# Altium schematic sheet ESenseFE-PreAmpAndMux.SchDoc
size C
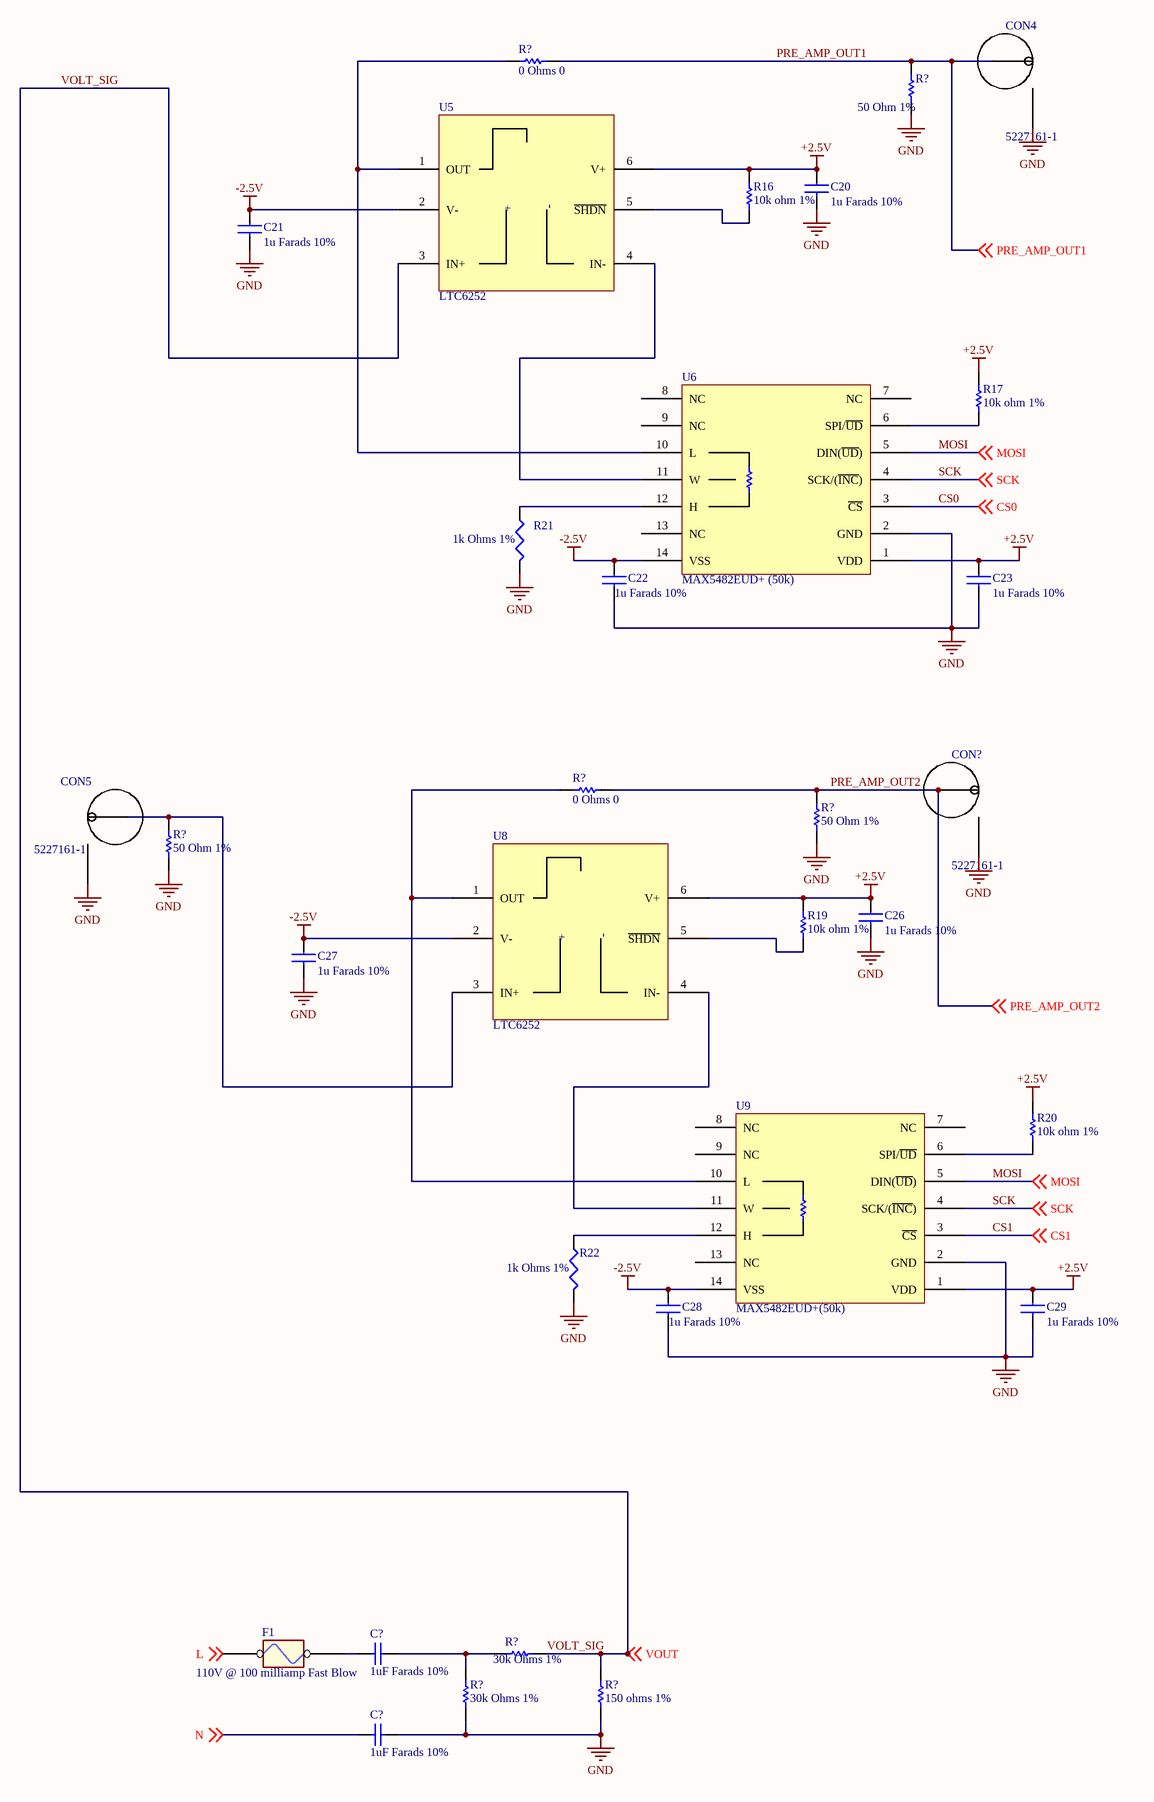
[diagram p0: ESenseFE-PreAmpAndMux.SchDoc]

## Parts
(Parts that share a designator on the sheet are numbered #1, #2 ... from top to bottom, then left to right.)
C20  1u Farads 10%  [SM/C_0603]
C21  1u Farads 10%  [SM/C_0603]
C22  1u Farads 10%  [SM/C_0603]
C23  1u Farads 10%  [SM/C_0603]
C26  1u Farads 10%  [SM/C_0603]
C27  1u Farads 10%  [SM/C_0603]
C28  1u Farads 10%  [SM/C_0603]
C29  1u Farads 10%  [SM/C_0603]
C?#1  1uF Farads 10%  [Y2-Caps-Epocs-1uF-10%]
C?#2  1uF Farads 10%  [Y2-Caps-Epocs-1uF-10%]
CON4  5227161-1  [BNC-RightAngle-PCB-50Ohm-Termination]
CON5  5227161-1  [BNC-RightAngle-PCB-50Ohm-Termination]
CON?  5227161-1  [BNC-RightAngle-PCB-50Ohm-Termination]
F1  110V @ 100 milliamp Fast Blow  [WICKMANN/WK0011-ND]
R16  10k ohm 1%  [SM/C_0603]
R17  10k ohm 1%  [SM/C_0603]
R19  10k ohm 1%  [SM/C_0603]
R20  10k ohm 1%  [SM/C_0603]
R21  1k Ohms 1%  [SM/C_0603]
R22  1k Ohms 1%  [SM/C_0603]
R?#1  0 Ohms 0  [SM/R_0603]
R?#2  50 Ohm 1%  [SM/R_0603]
R?#3  0 Ohms 0  [SM/R_0603]
R?#4  50 Ohm 1%  [SM/R_0603]
R?#5  50 Ohm 1%  [SM/R_0603]
R?#6  30k Ohms 1%  [SM/R_2512]
R?#7  30k Ohms 1%  [SM/R_2512]
R?#8  150 ohms 1%  [SM/R_2512]
U5  LTC6252  [TSOT-23-LTC6252-OpAmp]
U6  MAX5482EUD+ (50k)  [TSSOP-16Lead-MAX548X]
U8  LTC6252  [TSOT-23-LTC6252-OpAmp]
U9  MAX5482EUD+(50k)  [TSSOP-16Lead-MAX548X]

## Nets
+2.5V: C20.1 C23.1 C26.1 C29.1 R16.2 R17.2 R19.2 R20.2 U5.6(V+) U6.1(VDD) U8.6(V+) U9.1(VDD)
-2.5V: C21.1 C22.1 C27.1 C28.1 U5.2(V-) U6.14(VSS) U8.2(V-) U9.14(VSS)
GND: C20.2 C21.2 C22.2 C23.2 C26.2 C27.2 C28.2 C29.2 C?#2.2 CON4.2 CON5.2 CON?.2 R21.2 R22.2 R?#2.1 R?#4.1 R?#5.1 R?#7.1 R?#8.1 U6.2(GND) U9.2(GND)
CS0: U6.3(~{CS}) ; off-sheet CS0
CS1: U9.3(~{CS}) ; off-sheet CS1
L: F1.1 ; off-sheet L
MOSI: U6.5(DIN(~{UD})) U9.5(DIN(~{UD})) ; off-sheet MOSI
N: C?#2.1 ; off-sheet N
PRE_AMP_OUT1: CON4.1 R?#1.2 R?#2.2 ; off-sheet PRE_AMP_OUT1
PRE_AMP_OUT2: CON?.1 R?#3.2 R?#4.2 ; off-sheet PRE_AMP_OUT2
SCK: U6.4(SCK/(~{INC})) U9.4(SCK/(~{INC})) ; off-sheet SCK
VOLT_SIG: R?#6.1 R?#8.2 U5.3(IN+) ; off-sheet VOUT  [also labelled VOUT]
NetC?#1_1: C?#1.1 F1.2
NetC?#1_2: C?#1.2 R?#6.2 R?#7.2
NetCON5_1: CON5.1 R?#5.2 U8.3(IN+)
NetR16_1: R16.1 U5.5(~{SHDN})
NetR17_1: R17.1 U6.6(SPI/~{UD})
NetR19_1: R19.1 U8.5(~{SHDN})
NetR20_1: R20.1 U9.6(SPI/~{UD})
NetR21_1: R21.1 U6.12(H)
NetR22_1: R22.1 U9.12(H)
NetR?#1_1: R?#1.1 U5.1(OUT) U6.10(L)
NetR?#3_1: R?#3.1 U8.1(OUT) U9.10(L)
NetU5_4: U5.4(IN-) U6.11(W)
NetU8_4: U8.4(IN-) U9.11(W)

Not connected (* = marked no-connect by the designer): U6 7(NC) 8(NC) 9(NC) 13(NC); U9 7(NC) 8(NC) 9(NC) 13(NC)

## Notes on the sheet
- (in symbol 2192) +; -

## Library data of the parts
C20-C23 C26-C29 = 2065: CAP CER 1.0UF 10V 10% X5R 0603; mfrName: Murata Electronics North America; mfrPartNum: GRM188R61A105KA61D; Extra_Description: Datasheets	Chip Monolithic Ceramic Caps Part Numbering / GRM Series Spec/Test Methods (1) / GRM188R61A105KA61 / Product Photos	0603 Murata MLCC Caps / Product Training Modules	High-Cap Multilayer Ceramic Capacitors / Catalog Drawings	GRM Series Top, Sides / Standard Package	10 / Category	Capacitors / Family	Ceramic / Series	GRM / Capacitance	1.0µF / Voltage - Rated	10V / Tolerance	±10% / Temperature Coefficient	X5R / Mounting Type	Surface Mount, MLCC / Operating Temperature	-55°C ~ 85°C / Features	- / Applications	General Purpose / Ratings	- / Package / Case	0603 (1608 Metric) / Size / Dimension	0.063`` L x 0.032`` W (1.60mm x 0.80mm) / Lead Spacing	- / Thickness	0.80mm / Packaging	Cut Tape (CT) / Lead Style	- / Catalog Page	1886 (US2010 Interactive) / 1886 (US2010 PDF) / Other Names	490-1543-1; Obsolete: False; Temp_Max: 0; Type: Ceramic; PartID: 2065; URL_Image: HTTP://MEDIA.DIGIKEY.COM/PHOTOS/MURATA%20PHOTOS/0603%20MURATA%20MLCC%20CAPS.JPG; URL_Datasheet: http://search.murata.co.jp/Ceramy/image/img/w_hinm/L0005E.pdf; Date_Created: 9/27/2010 4:47:48 PM; Date_LastModified: 9/27/2010 4:47:48 PM; Verified: False; RoHS: True; Temp_Min: 0
C?#1 C?#2 = 2202: Y2 Caps 1uF Epocs; mfrName: EPCOS; mfrPartNum: B32026B3105K; Obsolete: False; Temp_Max: 0; Type: All Parts; TypeNotes: Applies to all parts in the database; Label: 1uF; PartID: 2202; Extra_Description: Y2 Caps 1uF Epocs; URL_Image: http://www.mouser.com/images/epcos/images/812007111135.jpg; URL_Datasheet: http://www.epcos.com/inf/20/20/db/fc_2009/Y2_B32021_026.pdf; Date_Created: 5/7/2011 9:37:20 PM; Date_LastModified: 5/7/2011 9:37:20 PM; Verified: False; RoHS: True; Temp_Min: 0
CON4 CON5 CON? = 2189: jack bnc, right angle, pcb; connector type:bnc, coaxial;; mfrName: Tyco Electronics; Extra_Description: JACK BNC, RIGHT ANGLE, PCB; Connector Type:BNC, Coaxial; Impedance:50ohm; Contact Material:Phosphor Bronze; Contact Plating:Tin; Body Style:Right Angle; Termination Method:PC Board; Mounting Type:PC Board; External Depth:35.56mm; External Length / Height:13.18mm; Material:VALOX; Width, External:14.76mm; Dielectric Material:Polymethylpentene / Contact Plating: ``Tin`` / Termination Style: ``Solder Lug`` / Gender: ``Female`` / Packaging: ``Bulk`` / RoHS: ``Compliant`` / Mounting Type: ``PC Board`` / Lead-Free Status: ``Lead Free`` / Contact Material: ``Phosphor Bronze`` / Housing Material: ``Polyester`` / Color: ``White`` / Size-Height: { / ``uncertainty_minus``: null, / ``value``: 0.015875, / ``uncertainty_plus``: null / } / Frequency: { / ``max_value``: 4000000000.0, / ``max_uncertainty_plus``: null, / ``min_value``: null, / ``min_uncertainty_plus``: null, / ``max_uncertainty_minus``: null / }; Obsolete: False; Temp_Max: 0; TypeNotes: Applies to all parts in the database; PartID: 2189; mfrPartNum: 5227161-1; URL_Image: http://cdn.sigma.octopart.com/9201634/image/Tyco-Electronics-5227161-1.jpg; URL_Datasheet: http://datasheet.octopart.com/5227161-1-Tyco-Electronics-datasheet-548244.pdf; Date_Created: 5/5/2011 8:50:02 AM; Date_LastModified: 5/5/2011 8:50:02 AM; Verified: False; RoHS: True; Temp_Min: 0; Type: All Parts
F1 = 1045: FUSEHOLDER OPEN 5X20MM PC MNT; mfrName: Wickmann USA, Inc.; mfrPartNum: 6490000100; Extra_Description: Wickmann USA, Inc. / TypeHolder / Fuse Size5mm x 20mm / MountingPCB / SpecificationsMiniature / MaterialThermoplastic, Black / Other Names19649 / 649 / WK0011; Type: Fuseholders; PartID: 1045; URL_Image: http://media.digikey.com/photos/Wickmann%20Photos/6490000100_sml.jpg; URL_Datasheet: http://www.digikey.com/scripts/DkSearch/dksus.dll?Pname?Name=WK0011-ND&Site=US; Date_Created: 8/1/2004 3:23:57 AM; Date_LastModified: 8/21/2009 1:12:53 AM; Verified: False
R16 R17 R19 R20 = 2165: resistor, 0603, 0.1w, 1%, 10k; resistance:10kohm; resistance; mfrName: Panasonic; mfrPartNum: ERJ-3EKF1002V; Value: 1K; Extra_Description: RESISTOR, 0603, 0.1W, 1%, 10K; Resistance:10kohm; Resistance Tolerance:± 1%; Power Rating:0.1W; Voltage Rating:75V; Series:ERJ; Temperature Coefficient:± 200ppm/°C; Resistor Element Type:Thick Film; Resistor Case Style:0603; No. of Pins:2; Case Style:0603; External Length / Height:0.45mm; External Depth:0.8mm; External Width:1.6mm; Operating Temperature Range:-55°C to +155°C; Overload Voltage:150V; Reel Quantity:5000; Termination Type:SMD / Mounting Type: ``Surface Mount`` / Case / Package: ``0603`` / Packaging: ``Cut Tape (CT)`` / Lead-Free Status: ``Contains Lead`` / RoHS: ``Compliant`` / Resistance: { / ``uncertainty_minus``: null, / ``value``: 10000.0, / ``uncertainty_plus``: null / } / Voltage Rating (DC): { / ``uncertainty_minus``: null, / ``value``: 75.0, / ``uncertainty_plus``: null / } / Size-Width: { / ``uncertainty_minus``: null, / ``value``: 0.0008, / ``uncertainty_plus``: null / } / Size-Length: { / ``uncertainty_minus``: null, / ``value``: 0.0016, / ``uncertainty_plus``: null / } / Size-Height: { / ``uncertainty_minus``: null, / ``value``: 0.00045, / ``uncertainty_plus``: null / } / Power Rating: { / ``uncertainty_minus``: null, / ``value``: 0.1, / ``uncertainty_plus``: null / } / Resistance Tolerance: { / ``max_value``: 1.0, / ``max_uncertainty_plus``: null, / ``min_value``: -1.0, / ``min_uncertainty_plus``: null, / ``max_uncertainty_minus``: null / } / Operating Temperature: { / ``max_value``: 125.0, / ``max_uncertainty_plus``: null, / ``min_value``: null, / ``min_uncertainty_plus``: null, / ``max_uncertainty_minus``: null / } / Number of Pins: 2; Obsolete: False; Temp_Max: 0; TypeNotes: Applies to all parts in the database; Published: 8-Jun-2000; LatestRevisionDate: 17-Jul-2002; LatestRevisionNote: Re-released for DXP Platform.; PackageReference: AXIAL-0.3; Publisher: Altium Limited; PartID: 2165; URL_Image: http://cdn.sigma.octopart.com/8893006/image/Panasonic-ERJ-3EKF1002V.jpg; URL_Datasheet: http://datasheet.octopart.com/ERJ-3EKF1002V-Panasonic-datasheet-118621.pdf; Date_Created: 4/24/2011 7:23:38 AM; Date_LastModified: 4/24/2011 7:23:38 AM; Verified: False; RoHS: True; Temp_Min: 0; Type: All Parts
R21 R22 = 2043: RES 1.00K OHM 1/10W 1% 0603 SMD; mfrName: Panasonic - ECG; mfrPartNum: ERJ-3EKF1001V; Extra_Description: Datasheets	ERJ-3EKF1001V View All Specifications / Product Photos	0603 Pkg / Catalog Drawings	1% Thick Film Chip Material / 1% Thick Film Chip / Standard Package	200 / Category	Resistors / Family	Chip Resistor - Surface Mount / Series	ERJ / Resistance In Ohms	1.00K / Power (Watts)	0.1W, 1/10W / Composition	Thick Film / Features	- / Temperature Coefficient	±100ppm/°C / Tolerance	±1% / Case	0603 (1608 metric) / Size / Dimension	0.063`` L x 0.031`` W (1.60mm x 0.80mm) / Height	0.018`` (0.45mm) / Lead Style	Surface Mount (SMD - SMT) / Packaging	Cut Tape (CT) / Catalog Page	1954 (US2010 Interactive) / 1954 (US2010 PDF) / Kits	RSM3H-ND - KIT CHIP RES 96 VALUES 50EA 0603 / Other Names	ERJ-3EKF1001 / ERJ3EKF1001 / P1.00KHCT; Obsolete: False; Temp_Max: 0; PartID: 2043; URL_Image: http://media.digikey.com/photos/Panasonic%20Photos/10-0603%20Resistor.jpg?cshift_ck=null&client_id=5042; URL_Datasheet: http://industrial.panasonic.com/www-cgi/jvcr13pz.cgi?E+PZ+3+AOA0002+ERJ3EKF1001V+7+WW; Date_Created: 9/14/2010 11:34:31 AM; Date_LastModified: 9/14/2010 11:34:31 AM; Verified: False; RoHS: True; Temp_Min: 0; Type: Chip Resistor - Surface Mount
R?#1 R?#3 = 2207: res thick film 0603 0 ohm 1/10w molded smd punched carrier; mfrName: Panasonic; mfrPartNum: ERJ-3GEY0R00V; Value: 1K; Extra_Description: RES 0.0 OHM 1/10W 0603 SMD / Mounting Type: ``Surface Mount`` / Case / Package: ``0603`` / Packaging: ``Cut Tape (CT)`` / Lead-Free Status: ``Lead Free`` / RoHS: ``Compliant`` / Size-Width: { / ``uncertainty_minus``: null, / ``value``: 0.0008, / ``uncertainty_plus``: null / } / Resistance: { / ``uncertainty_minus``: null, / ``value``: 0.0, / ``uncertainty_plus``: null / } / Size-Height: { / ``uncertainty_minus``: null, / ``value``: 0.00045, / ``uncertainty_plus``: null / } / Size-Length: { / ``uncertainty_minus``: null, / ``value``: 0.0016, / ``uncertainty_plus``: null / } / Resistance Tolerance: { / ``max_value``: 5.0, / ``max_uncertainty_plus``: null, / ``min_value``: -5.0, / ``min_uncertainty_plus``: null, / ``max_uncertainty_minus``: null / } / Operating Temperature: { / ``max_value``: 125.0, / ``max_uncertainty_plus``: null, / ``min_value``: null, / ``min_uncertainty_plus``: null, / ``max_uncertainty_minus``: null / }; Obsolete: False; Temp_Max: 0; TypeNotes: Applies to all parts in the database; Published: 8-Jun-2000; LatestRevisionDate: 17-Jul-2002; LatestRevisionNote: Re-released for DXP Platform.; PackageReference: AXIAL-0.3; Publisher: Altium Limited; PartID: 2207; URL_Image: http://cdn.sigma.octopart.com/8893006/image/Panasonic-ERJ-3GEY0R00V.jpg; URL_Datasheet: http://datasheet.octopart.com/ERJ-3GEY0R00V-Panasonic-datasheet-118655.pdf; Date_Created: 5/8/2011 9:32:29 AM; Date_LastModified: 5/8/2011 9:32:29 AM; Verified: False; RoHS: True; Temp_Min: 0; Type: All Parts
R?#2 R?#4 R?#5 = 2208: ; resistance:50ohm; resistance tolerance:± 0.1%; power; mfrName: Vishay; mfrPartNum: FC0603E50R0BTBST1; Value: 1K; Extra_Description: ; Resistance:50ohm; Resistance Tolerance:± 0.1%; Power Rating:125mW; Voltage Rating:50V; Temperature Coefficient:± 25ppm/°C; Resistor Element Material:Thin Film; Resistor Case Style:0603; No. of Pins:2 / Power Rating: { / ``uncertainty_minus``: null, / ``value``: 0.125, / ``uncertainty_plus``: null / } / Resistance: { / ``uncertainty_minus``: null, / ``value``: 50.0, / ``uncertainty_plus``: null / } / Voltage Rating (DC): { / ``uncertainty_minus``: null, / ``value``: 50.0, / ``uncertainty_plus``: null / } / Resistance Tolerance: { / ``max_value``: 0.1, / ``max_uncertainty_plus``: null, / ``min_value``: -0.1, / ``min_uncertainty_plus``: null, / ``max_uncertainty_minus``: null / } / Number of Pins: 2; Obsolete: False; Temp_Max: 0; TypeNotes: Applies to all parts in the database; Published: 8-Jun-2000; LatestRevisionDate: 17-Jul-2002; LatestRevisionNote: Re-released for DXP Platform.; PackageReference: AXIAL-0.3; Publisher: Altium Limited; PartID: 2208; URL_Image: http://cdn.sigma.octopart.com/8908821/image/Vishay-FC0603E50R0BTBST1.jpg; URL_Datasheet: http://; Date_Created: 5/8/2011 9:43:35 AM; Date_LastModified: 5/8/2011 9:43:35 AM; Verified: False; RoHS: True; Temp_Min: 0; Type: All Parts
R?#6 R?#7 = 2203: single components passive components resistors; mfrName: Panasonic; mfrPartNum: ERJ-1TNF3002U; Value: 1K; Extra_Description: RES 30.0K OHM 1W 1% 2512 SMD / Mounting Type: ``Surface Mount`` / Case / Package: ``2512`` / Packaging: ``Cut Tape (CT)`` / Lead-Free Status: ``Lead Free`` / RoHS: ``Compliant`` / Size-Width: { / ``uncertainty_minus``: null, / ``value``: 0.0032, / ``uncertainty_plus``: null / } / Resistance: { / ``uncertainty_minus``: null, / ``value``: 30000.0, / ``uncertainty_plus``: null / } / Size-Height: { / ``uncertainty_minus``: null, / ``value``: 0.0006, / ``uncertainty_plus``: null / } / Size-Length: { / ``uncertainty_minus``: null, / ``value``: 0.0064, / ``uncertainty_plus``: null / } / Resistance Tolerance: { / ``max_value``: 1.0, / ``max_uncertainty_plus``: null, / ``min_value``: -1.0, / ``min_uncertainty_plus``: null, / ``max_uncertainty_minus``: null / } / Operating Temperature: { / ``max_value``: 125.0, / ``max_uncertainty_plus``: null, / ``min_value``: null, / ``min_uncertainty_plus``: null, / ``max_uncertainty_minus``: null / }; Obsolete: False; Temp_Max: 0; TypeNotes: Applies to all parts in the database; Published: 8-Jun-2000; LatestRevisionDate: 17-Jul-2002; LatestRevisionNote: Re-released for DXP Platform.; PackageReference: AXIAL-0.3; Publisher: Altium Limited; PartID: 2203; URL_Image: http://cdn.sigma.octopart.com/8892366/image/Panasonic-ERJ-1TNF3002U.jpg; URL_Datasheet: http://industrial.panasonic.com/www-data/pdf/AOA0000/AOA0000PE3.pdf; Date_Created: 5/7/2011 10:12:00 PM; Date_LastModified: 5/7/2011 10:12:00 PM; Verified: False; RoHS: True; Temp_Min: 0; Type: All Parts
R?#8 = 2204: single components passive components resistors; mfrName: Panasonic; mfrPartNum: ERJ-1TNF15R0U; Value: 1K; Extra_Description: RES 15.0 OHM 1W 1% 2512 SMD / Mounting Type: ``Surface Mount`` / Case / Package: ``2512`` / Packaging: ``Cut Tape (CT)`` / Lead-Free Status: ``Lead Free`` / RoHS: ``Compliant`` / Size-Width: { / ``uncertainty_minus``: null, / ``value``: 0.0032, / ``uncertainty_plus``: null / } / Resistance: { / ``uncertainty_minus``: null, / ``value``: 15.0, / ``uncertainty_plus``: null / } / Size-Height: { / ``uncertainty_minus``: null, / ``value``: 0.0006, / ``uncertainty_plus``: null / } / Size-Length: { / ``uncertainty_minus``: null, / ``value``: 0.0064, / ``uncertainty_plus``: null / } / Resistance Tolerance: { / ``max_value``: 1.0, / ``max_uncertainty_plus``: null, / ``min_value``: -1.0, / ``min_uncertainty_plus``: null, / ``max_uncertainty_minus``: null / } / Operating Temperature: { / ``max_value``: 125.0, / ``max_uncertainty_plus``: null, / ``min_value``: null, / ``min_uncertainty_plus``: null, / ``max_uncertainty_minus``: null / }; Obsolete: False; Temp_Max: 0; TypeNotes: Applies to all parts in the database; Published: 8-Jun-2000; LatestRevisionDate: 17-Jul-2002; LatestRevisionNote: Re-released for DXP Platform.; PackageReference: AXIAL-0.3; Publisher: Altium Limited; PartID: 2204; URL_Image: http://cdn.sigma.octopart.com/8892366/image/Panasonic-ERJ-1TNF15R0U.jpg; URL_Datasheet: http://industrial.panasonic.com/www-data/pdf/AOA0000/AOA0000PE3.pdf; Date_Created: 5/7/2011 10:15:26 PM; Date_LastModified: 5/7/2011 10:15:26 PM; Verified: False; RoHS: True; Temp_Min: 0; Type: All Parts
U5 U8 = 2192: op amp, r/r 200mhz single, soic8; no. of amplifiers:1; op amp; mfrName: Linear Technology; Extra_Description: Family	Linear - Amplifiers - Instrumentation, OP Amps, Buffer Amps / Series	- / Amplifier Type	General Purpose / Number of Circuits	1 / Output Type	Rail-to-Rail / Slew Rate	280 V/µs / Gain Bandwidth Product	720MHz / -3db Bandwidth	400MHz / Current - Input Bias	1.4µA / Voltage - Input Offset	100µV / Current - Supply	4.25mA / Current - Output / Channel	100mA / Voltage - Supply, Single/Dual (±)	2.5 V ~ 5.25 V, ±1.25 V ~ 2.625 V / Operating Temperature	-40°C ~ 125°C / Mounting Type	Surface Mount / Package / Case	SOT-23-6 Thin, TSOT-23-6 / Supplier Device Package	TSOT-23-6 / Packaging	Digi-Reel® / Other Names	LTC6252HS6#TRMPBFDKR / Alternate Package / This part is also available in the following packaging:; Obsolete: False; Temp_Max: 0; TypeNotes: Applies to all parts in the database; PartID: 2192; mfrPartNum: LTC6252; URL_Image: http://cds.linear.com/images/product/4358_pack_1.jpg; URL_Datasheet: http://datasheet.octopart.com/LTC6240CS8%23PBF-Linear-Technology-datasheet-502703.pdf; Date_Created: 5/5/2011 10:07:10 AM; Date_LastModified: 5/5/2011 10:07:10 AM; Verified: False; RoHS: True; Temp_Min: 0; Type: All Parts
U6 U9 = 2194: dpot, nv, linear taper, 10 bit, smd; resistance range; mfrName: MAXIM; mfrPartNum: MAX5482EUD+(1); Extra_Description: DPOT, NV, LINEAR TAPER, 10 BIT, SMD; Resistance Range Type:Linear; Memory Type:Non-Volatile; No. of Channels:1; No. of Positions:1024; Resistance, End-to-End:10kohm; Interface Type:SPI, Serial, 3 Wire; Voltage, Supply Min:2.7V; Voltage, Supply Max:5.25V; Termination Type:SMD; Case Style:TSSOP; No. of Pins:14; Operating Temperature Range:-40°C to +85°C; Temp, Op. Max:85°C; Temp, Op. Min:-40°C; Base Number:5483; Supply Voltage:2.7V; Track Resistance:10kohm / RoHS: ``Compliant`` / Supply Voltage (DC): { / ``uncertainty_minus``: null, / ``value``: 2.7, / ``uncertainty_plus``: null / } / Resistance Tolerance: { / ``max_value``: 25.0, / ``max_uncertainty_plus``: null, / ``min_value``: -25.0, / ``min_uncertainty_plus``: null, / ``max_uncertainty_minus``: null / } / Number of Pins: 14; Obsolete: False; Temp_Max: 0; TypeNotes: Applies to all parts in the database; PartID: 2194; URL_Image: http://cdn.sigma.octopart.com/8907955/image/Maxim-MAX5483EUD%2B.jpg; URL_Datasheet: http://datasheet.octopart.com/MAX5483EUD%2B-Maxim-datasheet-529274.pdf; Date_Created: 5/5/2011 10:56:31 AM; Date_LastModified: 5/5/2011 10:56:31 AM; Verified: False; RoHS: True; Temp_Min: 0; Type: All Parts